# Altium project power_board.PrjPcb
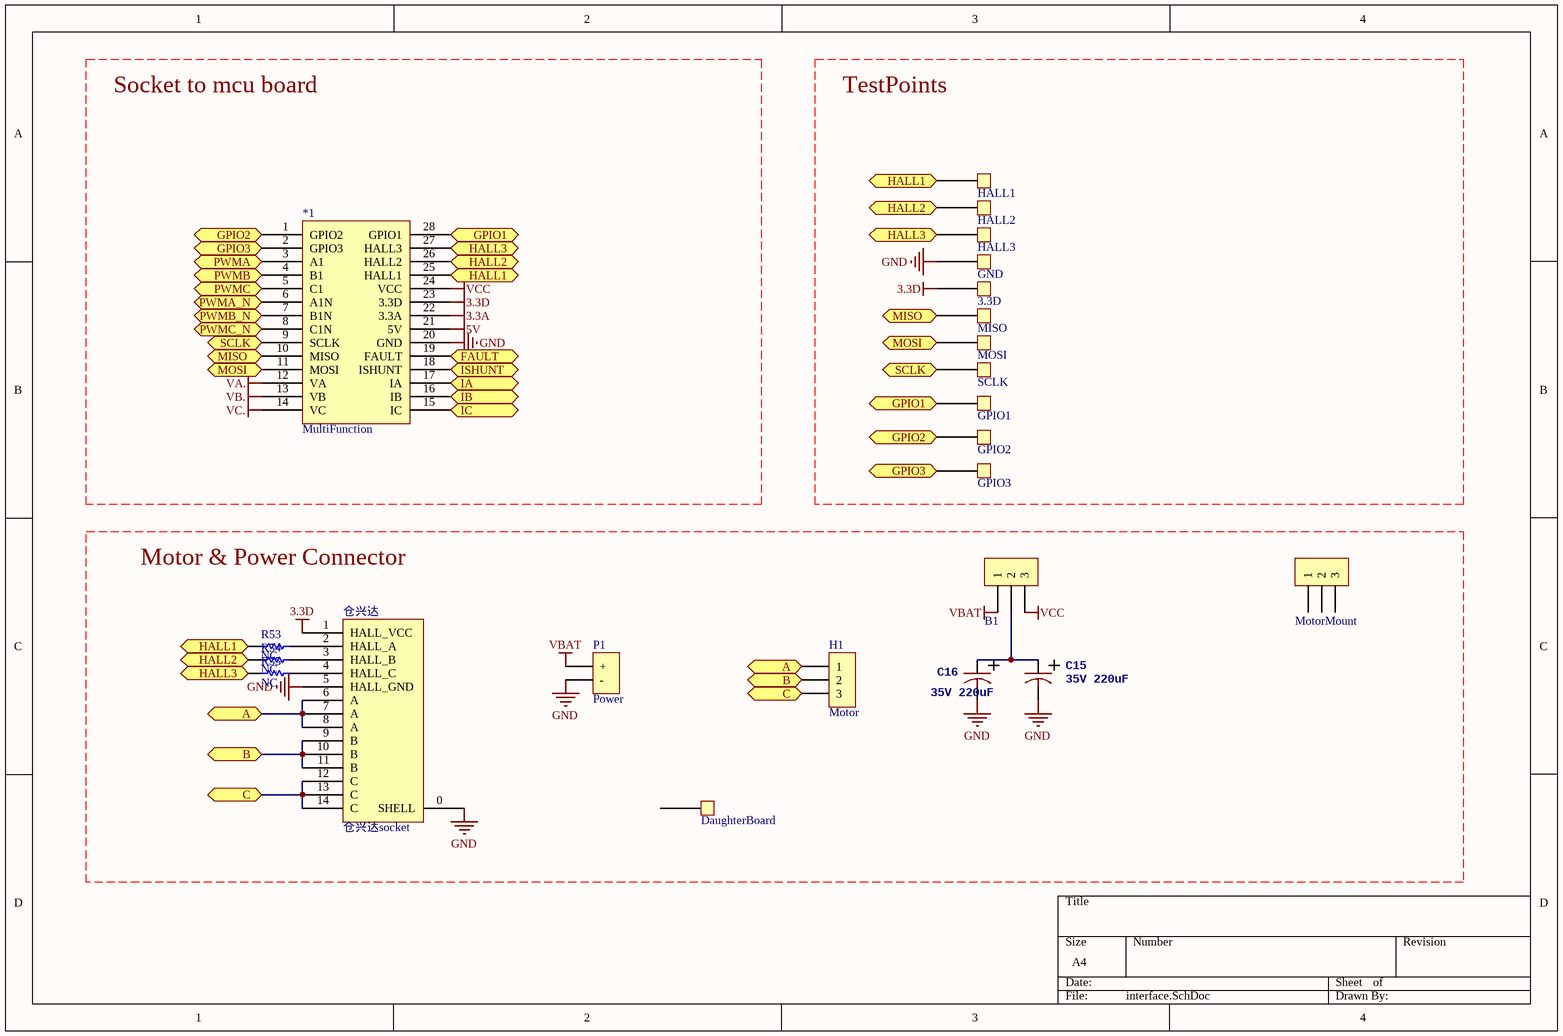
[diagram p0: interface.SchDoc]
5 sheets, 118 parts. Net scope: flat (ports and power ports of the same name join across sheets).
Board file: power.PcbDoc
Sheets:
  interface.SchDoc
  drv8313.SchDoc
  drive-mp1907.SchDoc
  signal_conditioning.SchDoc
  sensor.SchDoc

## Sheet interface.SchDoc
size A4

### Parts
3.3D  TestPad  [TestPad]  (value not drawn)
*1  MultiFunction  [MultiFunction]
B1  RX  [SolderBridge60mil]  (value not drawn)
C15  35V 220uF  [HONOR_63X77]
C16  35V 220uF  [HONOR_63X77]
DaughterBoard  TestPad  [DaughterBoardHolder]  (value not drawn)
GND  TestPad  [TestPad]  (value not drawn)
GPIO1  TestPad  [TestPad]  (value not drawn)
GPIO2  TestPad  [TestPad]  (value not drawn)
GPIO3  TestPad  [TestPad]  (value not drawn)
H1  Motor  [MotorConnector2.5mm*3]
HALL1  TestPad  [TestPad]  (value not drawn)
HALL2  TestPad  [TestPad]  (value not drawn)
HALL3  TestPad  [TestPad]  (value not drawn)
MISO  TestPad  [TestPad]  (value not drawn)
MOSI  TestPad  [TestPad]  (value not drawn)
MotorMount  RX  [MotorMount]  (value not drawn)
P1  Power  [Power]
R53  NC  [0603]
R54  NC  [0603]
R55  NC  [0603]
SCLK  TestPad  [TestPad]  (value not drawn)
仓兴达  仓兴达socket  [FPC-0.5mm-14]

### Ports
A, B, C, FAULT, GPIO1, GPIO2, GPIO3, HALL1, HALL2, HALL3, IA, IB, IC, ISHUNT, MISO, MOSI, PWMA, PWMA_N, PWMB, PWMB_N, PWMC, PWMC_N, SCLK

### Nets
3.3A: *1.22(3.3A)
3.3D: 3.3D.1 *1.23(3.3D) 仓兴达.1(HALL_VCC)
5V: *1.21(5V)
GND: *1.20(GND) C15.2 C16.2 GND.1 P1.2(-) 仓兴达.0(SHELL) 仓兴达.5(HALL_GND)
VA.: *1.12(VA)
VB.: *1.13(VB)
VBAT: B1.1 P1.1(+)
VC.: *1.14(VC)
VCC: *1.24(VCC) B1.3
Net8313_5: H1.1 仓兴达.6(A) 仓兴达.7(A) 仓兴达.8(A) ; port A
Net8313_8: H1.2 仓兴达.9(B) 仓兴达.10(B) 仓兴达.11(B) ; port B
Net8313_9: H1.3 仓兴达.12(C) 仓兴达.13(C) 仓兴达.14(C) ; port C
Net8313_22: *1.25(HALL1) HALL1.1 R53.1 ; port HALL1
Net8313_23: *1.5(C1) ; port PWMC
Net8313_25: *1.4(B1) ; port PWMB
Net8313_27: *1.3(A1) ; port PWMA
Net*1_1: *1.1(GPIO2) GPIO2.1 ; port GPIO2
Net*1_2: *1.2(GPIO3) GPIO3.1 ; port GPIO3
Net*1_6: *1.6(A1N) ; port PWMA_N
Net*1_7: *1.7(B1N) ; port PWMB_N
Net*1_8: *1.8(C1N) ; port PWMC_N
Net*1_9: *1.9(SCLK) SCLK.1 ; port SCLK
Net*1_10: *1.10(MISO) MISO.1 ; port MISO
Net*1_11: *1.11(MOSI) MOSI.1 ; port MOSI
Net*1_15: *1.15(IC) ; port IC
Net*1_16: *1.16(IB) ; port IB
Net*1_17: *1.17(IA) ; port IA
Net*1_18: *1.18(ISHUNT) ; port ISHUNT
Net*1_19: *1.19(FAULT) ; port FAULT
Net*1_26: *1.26(HALL2) HALL2.1 R54.1 ; port HALL2
Net*1_27: *1.27(HALL3) HALL3.1 R55.1 ; port HALL3
Net*1_28: *1.28(GPIO1) GPIO1.1 ; port GPIO1
NetB1_2: B1.2 C15.1 C16.1
NetR53_2: R53.2 仓兴达.2(HALL_A)
NetR54_2: R54.2 仓兴达.3(HALL_B)
NetR55_2: R55.2 仓兴达.4(HALL_C)

Not connected (* = marked no-connect by the designer): DaughterBoard 1(3); MotorMount 1 2 3

### Notes on the sheet
- Socket to mcu board
- TestPoints
- Motor & Power Connector

### Library data of the parts
B1 MotorMount = SolderBridge: Connector
C15 C16 = C-USC0402: 电容
H1 = CON3: Connector
P1 = PowerCon: Connector
R53-R55 = Res1: Resistor; Value: 10K; Published: 8-Jun-2000; LatestRevisionDate: 17-Jul-2002; LatestRevisionNote: Re-released for DXP Platform.; PackageReference: AXIAL-0.3; Publisher: Altium Limited; PackageDescription: Axial Device, Thru-Hole; 2 Leads; 0.3 in Pin Spacing

## Sheet drv8313.SchDoc
size A4
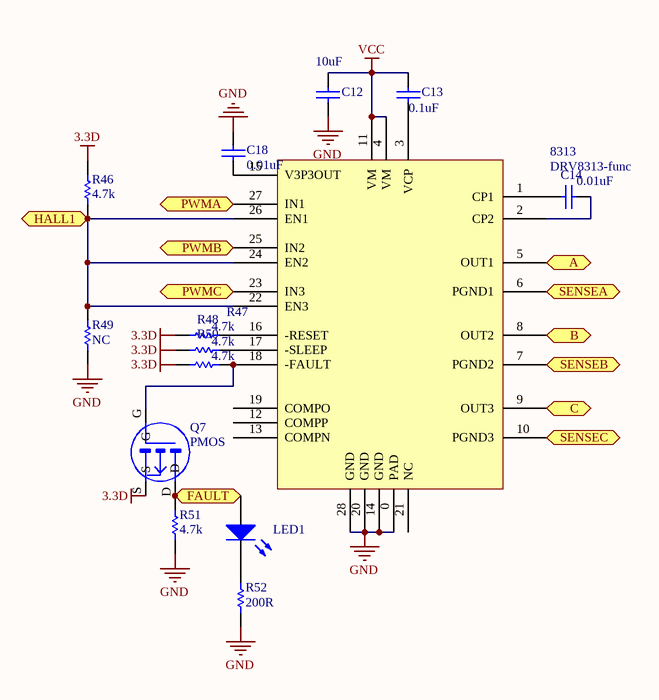
[diagram p1: drv8313.SchDoc]

### Parts
8313  DRV8313-func  [DRV8313]
C12  10uF  [0805]
C13  0.1uF  [0603]
C14  0.01uF  [0603]
C18  0.01uF  [0603]
LED1  LED0  [0603]  (value not drawn)
Q7  PMOS  [SOT-23B_L]
R46  4.7k  [0603]
R47  4.7k  [0603]
R48  4.7k  [0603]
R49  NC  [0603]
R50  4.7k  [0603]
R51  4.7k  [0603]
R52  200R  [0603]

### Ports
A, B, C, FAULT, HALL1, PWMA, PWMB, PWMC, SENSEA, SENSEB, SENSEC

### Nets
3.3D: Q7.S R46.1 R47.1 R48.1 R50.1
GND: 8313.0(PAD) 8313.14(GND) 8313.20(GND) 8313.28(GND) C12.1 C18.2 R49.2 R51.1 R52.1
VCC: 8313.4(VM) 8313.11(VM) C12.2 C13.1
Net8313_1: 8313.1(CP1) C14.1
Net8313_2: 8313.2(CP2) C14.2
Net8313_3: 8313.3(VCP) C13.2
Net8313_5: 8313.5(OUT1) ; port A
Net8313_6: 8313.6(PGND1) ; port SENSEA
Net8313_7: 8313.7(PGND2) ; port SENSEB
Net8313_8: 8313.8(OUT2) ; port B
Net8313_9: 8313.9(OUT3) ; port C
Net8313_10: 8313.10(PGND3) ; port SENSEC
Net8313_15: 8313.15(V3P3OUT) C18.1
Net8313_16: 8313.16(-RESET) R47.2
Net8313_17: 8313.17(-SLEEP) R48.2
Net8313_18: 8313.18(-FAULT) Q7.G R50.2
Net8313_22: 8313.22(EN3) 8313.24(EN2) 8313.26(EN1) R46.2 R49.1 ; port HALL1
Net8313_23: 8313.23(IN3) ; port PWMC
Net8313_25: 8313.25(IN2) ; port PWMB
Net8313_27: 8313.27(IN1) ; port PWMA
Net*1_19: LED1.1(A) Q7.D R51.2 ; port FAULT
NetLED1_2: LED1.2(K) R52.2

Not connected (* = marked no-connect by the designer): 8313 12(COMPP) 13(COMPN) 19(COMPO) 21(NC)

### Library data of the parts
C12 C13 = Cap: Capacitor; Published: 8-Jun-2000; LatestRevisionDate: 17-Jul-2002; LatestRevisionNote: Re-released for DXP Platform.; PackageReference: RAD-0.3; Publisher: Altium Limited; PackageDescription: Radial Cap, Thru-Hole; 2 Leads; 0.3 in Pin Spacing
  C12: Value: 10uF
  C13: Value: 0.1uf
C14 C18 = Cap: Capacitor; Value: 0.1uf; Published: 8-Jun-2000; LatestRevisionDate: 17-Jul-2002; LatestRevisionNote: Re-released for DXP Platform.; PackageReference: RAD-0.3; Publisher: Altium Limited; PackageDescription: Radial Cap, Thru-Hole; 2 Leads; 0.3 in Pin Spacing
LED1 = LED0: LED; Published: 8-Jun-2000; LatestRevisionDate: 08-Jul-2005; LatestRevisionNote: Mech Layer 1 removed.; PackageReference: LED-0; Publisher: Altium Limited; PackageDescription: LED; 2 Leads
Q7 = PMOS: pin to pad: D>3 G>1 S>2
R46-R52 = Res1: Resistor; Value: 10K; Published: 8-Jun-2000; LatestRevisionDate: 17-Jul-2002; LatestRevisionNote: Re-released for DXP Platform.; PackageReference: AXIAL-0.3; Publisher: Altium Limited; PackageDescription: Axial Device, Thru-Hole; 2 Leads; 0.3 in Pin Spacing

## Sheet drive-mp1907.SchDoc
size A3
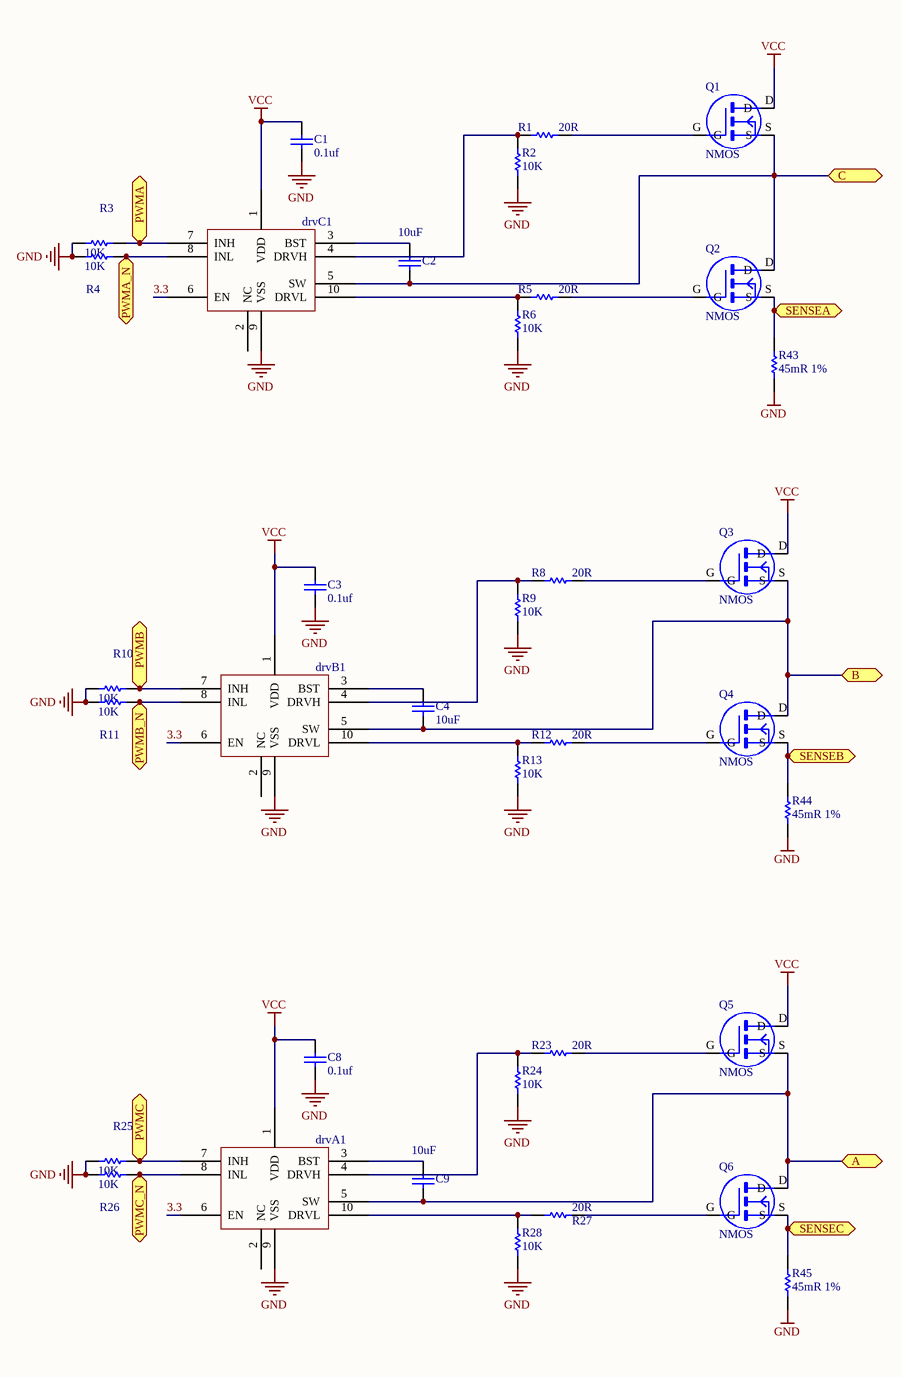
[diagram p2: drive-mp1907.SchDoc]

### Parts
C1  value 0.1uf  [0603]  (hidden comment: Cap)
C2  10uF  [0805]
C3  value 0.1uf  [0603]  (hidden comment: Cap)
C4  value 10uF  [0805]  (hidden comment: Cap)
C8  value 0.1uf  [0603]  (hidden comment: Cap)
C9  10uF  [0805]
drvA1  MP1907  [MP1907]  (value not drawn)
drvB1  MP1907  [MP1907]  (value not drawn)
drvC1  MP1907  [MP1907]  (value not drawn)
Q1  NMOS  [BSC025N03MS]
Q2  NMOS  [BSC025N03MS]
Q3  NMOS  [BSC025N03MS]
Q4  NMOS  [BSC025N03MS]
Q5  NMOS  [BSC025N03MS]
Q6  NMOS  [BSC025N03MS]
R1  value 20R  [0603]  (hidden comment: Res1)
R2  value 10K  [0603]  (hidden comment: Res1)
R3  value 10K  [0603]  (hidden comment: Res1)
R4  value 10K  [0603]  (hidden comment: Res1)
R5  value 20R  [0603]  (hidden comment: Res1)
R6  value 10K  [0603]  (hidden comment: Res1)
R8  value 20R  [0603]  (hidden comment: Res1)
R9  value 10K  [0603]  (hidden comment: Res1)
R10  value 10K  [0603]  (hidden comment: Res1)
R11  value 10K  [0603]  (hidden comment: Res1)
R12  value 20R  [0603]  (hidden comment: Res1)
R13  value 10K  [0603]  (hidden comment: Res1)
R23  value 20R  [0603]  (hidden comment: Res1)
R24  value 10K  [0603]  (hidden comment: Res1)
R25  value 10K  [0603]  (hidden comment: Res1)
R26  value 10K  [0603]  (hidden comment: Res1)
R27  value 20R  [0603]  (hidden comment: Res1)
R28  value 10K  [0603]  (hidden comment: Res1)
R43  45mR 1%  [2512]
R44  45mR 1%  [2512]
R45  45mR 1%  [2512]

### Ports
A, B, C, PWMA, PWMA_N, PWMB, PWMB_N, PWMC, PWMC_N, SENSEA, SENSEB, SENSEC

### Nets
GND: C1.2 C3.2 C8.2 drvA1.9(VSS) drvB1.9(VSS) drvC1.9(VSS) R2.2 R3.2 R4.2 R6.2 R9.2 R10.2 R11.2 R13.2 R24.2 R25.2 R26.2 R28.2 R43.1 R44.1 R45.1
VCC: C1.1 C3.1 C8.1 drvA1.1(VDD) drvB1.1(VDD) drvC1.1(VDD) Q1.D Q3.D Q5.D
3.3: drvA1.6(EN) drvB1.6(EN) drvC1.6(EN)
Net8313_5: C9.1 drvA1.5(SW) Q5.S Q6.D ; port A
Net8313_6: Q2.S R43.2 ; port SENSEA
Net8313_7: Q4.S R44.2 ; port SENSEB
Net8313_8: C4.1 drvB1.5(SW) Q3.S Q4.D ; port B
Net8313_9: C2.1 drvC1.5(SW) Q1.S Q2.D ; port C
Net8313_10: Q6.S R45.2 ; port SENSEC
Net8313_23: drvA1.7(INH) R25.1 ; port PWMC
Net8313_25: drvB1.7(INH) R10.1 ; port PWMB
Net8313_27: drvC1.7(INH) R3.1 ; port PWMA
Net*1_6: drvC1.8(INL) R4.1 ; port PWMA_N
Net*1_7: drvB1.8(INL) R11.1 ; port PWMB_N
Net*1_8: drvA1.8(INL) R26.1 ; port PWMC_N
NetC2_2: C2.2 drvC1.3(BST)
NetC4_2: C4.2 drvB1.3(BST)
NetC9_2: C9.2 drvA1.3(BST)
NetdrvA1_4: drvA1.4(DRVH) R23.2 R24.1
NetdrvA1_10: drvA1.10(DRVL) R27.2 R28.1
NetdrvB1_4: drvB1.4(DRVH) R8.2 R9.1
NetdrvB1_10: drvB1.10(DRVL) R12.2 R13.1
NetdrvC1_4: drvC1.4(DRVH) R1.2 R2.1
NetdrvC1_10: drvC1.10(DRVL) R5.2 R6.1
NetQ1_G: Q1.G R1.1
NetQ2_G: Q2.G R5.1
NetQ3_G: Q3.G R8.1
NetQ4_G: Q4.G R12.1
NetQ5_G: Q5.G R23.1
NetQ6_G: Q6.G R27.1

Not connected (* = marked no-connect by the designer): drvA1 2(NC); drvB1 2(NC); drvC1 2(NC)

### Library data of the parts
C1 C3 C4 C8 = Cap: Capacitor; Published: 8-Jun-2000; LatestRevisionDate: 17-Jul-2002; LatestRevisionNote: Re-released for DXP Platform.; PackageReference: RAD-0.3; Publisher: Altium Limited; PackageDescription: Radial Cap, Thru-Hole; 2 Leads; 0.3 in Pin Spacing
C2 C9 = Cap: Capacitor; Value: 0.1uf; Published: 8-Jun-2000; LatestRevisionDate: 17-Jul-2002; LatestRevisionNote: Re-released for DXP Platform.; PackageReference: RAD-0.3; Publisher: Altium Limited; PackageDescription: Radial Cap, Thru-Hole; 2 Leads; 0.3 in Pin Spacing
R1-R6 R8-R13 R23-R28 = Res1: Resistor; Published: 8-Jun-2000; LatestRevisionDate: 17-Jul-2002; LatestRevisionNote: Re-released for DXP Platform.; PackageReference: AXIAL-0.3; Publisher: Altium Limited; PackageDescription: Axial Device, Thru-Hole; 2 Leads; 0.3 in Pin Spacing
R43-R45 = Res1: Resistor; Value: 10K; Published: 8-Jun-2000; LatestRevisionDate: 17-Jul-2002; LatestRevisionNote: Re-released for DXP Platform.; PackageReference: AXIAL-0.3; Publisher: Altium Limited; PackageDescription: Axial Device, Thru-Hole; 2 Leads; 0.3 in Pin Spacing

## Sheet signal_conditioning.SchDoc
size A4
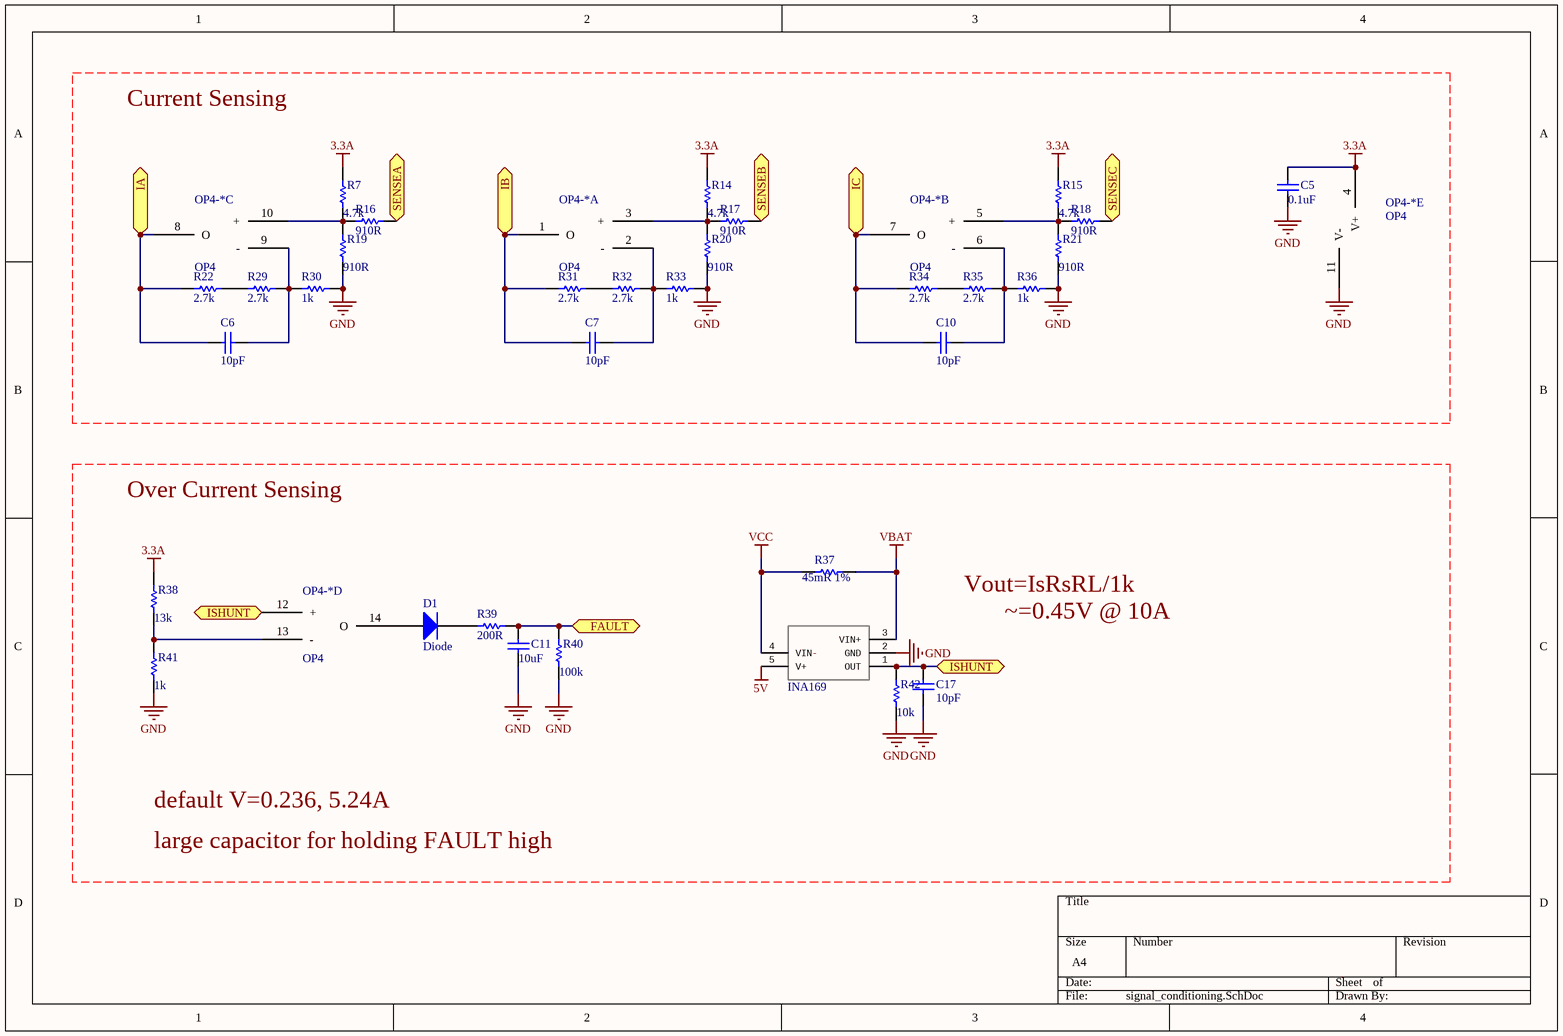
[diagram p3: signal_conditioning.SchDoc]

### Parts
C5  0.1uF  [0603]
C6  10pF  [0603]
C7  10pF  [0603]
C10  10pF  [0603]
C11  10uF  [0805]
C17  10pF  [0603]
D1  Diode  [0805]
OP4-*  OP4  [SOP14]  (parts A,B,C,D,E of 5)
R7  4.7k  [0603]
R14  4.7k  [0603]
R15  4.7k  [0603]
R16  910R  [0603]
R17  910R  [0603]
R18  910R  [0603]
R19  910R  [0603]
R20  910R  [0603]
R21  910R  [0603]
R22  2.7k  [0603]
R29  2.7k  [0603]
R30  1k  [0603]
R31  2.7k  [0603]
R32  2.7k  [0603]
R33  1k  [0603]
R34  2.7k  [0603]
R35  2.7k  [0603]
R36  1k  [0603]
R37  45mR 1%  [2512]
R38  13k  [0603]
R39  200R  [0603]
R40  100k  [0603]
R41  1k  [0603]
R42  10k  [0603]
U$1  INA169  [SOT23-5]

### Ports
FAULT, IA, IB, IC, ISHUNT, SENSEA, SENSEB, SENSEC

### Nets
3.3A: C5.1 OP4-*.4(V+) R7.2 R14.2 R15.2 R38.2
5V: U$1.5(V+)
GND: C5.2 C11.2 C17.1 OP4-*.11(V-) R19.1 R20.1 R21.1 R30.1 R33.1 R36.1 R40.1 R41.1 R42.1 U$1.2(GND)
VBAT: R37.2 U$1.3(VIN+)
VCC: R37.1 U$1.4(VIN-)
Net8313_6: R16.1 ; port SENSEA
Net8313_7: R17.1 ; port SENSEB
Net8313_10: R18.1 ; port SENSEC
Net*1_15: C10.1 OP4-*.7(O) R34.2 ; port IC
Net*1_16: C7.1 OP4-*.1(O) R31.2 ; port IB
Net*1_17: C6.1 OP4-*.8(O) R22.2 ; port IA
Net*1_18: C17.2 OP4-*.12(+) R42.2 U$1.1(OUT) ; port ISHUNT
Net*1_19: C11.1 R39.1 R40.2 ; port FAULT
NetC6_2: C6.2 OP4-*.9(-) R29.1 R30.2
NetC7_2: C7.2 OP4-*.2(-) R32.1 R33.2
NetC10_2: C10.2 OP4-*.6(-) R35.1 R36.2
NetD1_1: D1.1(A) OP4-*.14(O)
NetD1_2: D1.2(K) R39.2
NetOP4-*_3: OP4-*.3(+) R14.1 R17.2 R20.2
NetOP4-*_5: OP4-*.5(+) R15.1 R18.2 R21.2
NetOP4-*_10: OP4-*.10(+) R7.1 R16.2 R19.2
NetOP4-*_13: OP4-*.13(-) R38.1 R41.2
NetR22_1: R22.1 R29.2
NetR31_1: R31.1 R32.2
NetR34_1: R34.1 R35.2

### Notes on the sheet
- Current Sensing
- Over Current Sensing
- Vout=IsRsRL/1k
- ~=0.45V @ 10A
- default V=0.236, 5.24A
- large capacitor for holding FAULT high

### Library data of the parts
C5 = Cap: Capacitor; Published: 8-Jun-2000; LatestRevisionDate: 17-Jul-2002; LatestRevisionNote: Re-released for DXP Platform.; PackageReference: RAD-0.3; Publisher: Altium Limited; PackageDescription: Radial Cap, Thru-Hole; 2 Leads; 0.3 in Pin Spacing; Value: 0.1uf
C6 C7 C10 C11 C17 = Cap: Capacitor; Value: 0.1uf; Published: 8-Jun-2000; LatestRevisionDate: 17-Jul-2002; LatestRevisionNote: Re-released for DXP Platform.; PackageReference: RAD-0.3; Publisher: Altium Limited; PackageDescription: Radial Cap, Thru-Hole; 2 Leads; 0.3 in Pin Spacing
D1 = Diode: Default Diode; Published: 8-Jun-2000; LatestRevisionDate: 17-Jul-2002; LatestRevisionNote: Re-released for DXP Platform.; PackageVersion: Sep-1996; PackageReference: SMC; Publisher: Altium Limited; PackageDescription: DO-214-AB/SMC; 2 C-Bend Leads; Body 7.9 x 5.9 mm, inc. leads (LxW); Code_JEDEC: DO-214-AB
R7 R14-R22 R29-R41 = Res1: Resistor; Value: 10K; Published: 8-Jun-2000; LatestRevisionDate: 17-Jul-2002; LatestRevisionNote: Re-released for DXP Platform.; PackageReference: AXIAL-0.3; Publisher: Altium Limited; PackageDescription: Axial Device, Thru-Hole; 2 Leads; 0.3 in Pin Spacing
R42 = Res1: Resistor; Published: 8-Jun-2000; LatestRevisionDate: 17-Jul-2002; LatestRevisionNote: Re-released for DXP Platform.; PackageReference: AXIAL-0.3; Publisher: Altium Limited; PackageDescription: Axial Device, Thru-Hole; 2 Leads; 0.3 in Pin Spacing; Value: 10K

## Sheet sensor.SchDoc
size A4
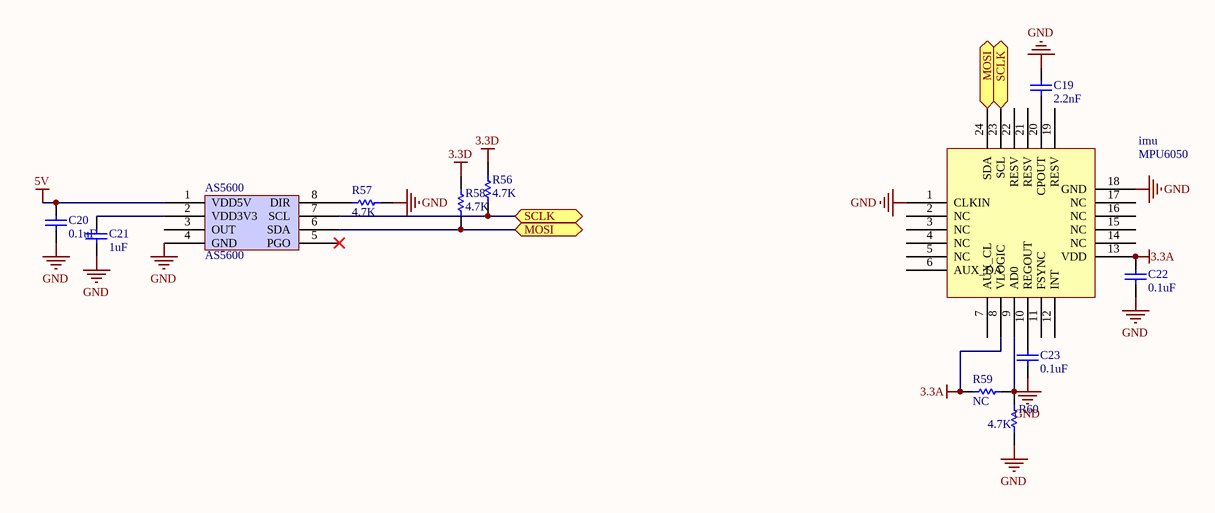
[diagram p4: sensor.SchDoc]

### Parts
AS5600  AS5600  [SOIC8_39MM]
C19  2.2nF  [0603]
C20  0.1uF  [0603]
C21  1uF  [0603]
C22  0.1uF  [0603]
C23  0.1uF  [0603]
imu  MPU6050  [MPU6050-2]
R56  4.7K  [0603]
R57  4.7K  [0603]
R58  4.7K  [0603]
R59  NC  [0603]
R60  4.7K  [0603]

### Ports
MOSI, SCLK

### Nets
3.3A: C22.2 imu.8(VLOGIC) imu.13(VDD) R59.1
3.3D: R56.2 R58.2
5V: AS5600.1(VDD5V) C20.1
GND: AS5600.4(GND) C19.2 C20.2 C21.1 C22.1 C23.1 imu.1(CLKIN) imu.18(GND) R57.2 R60.2
Net*1_9: AS5600.7(SCL) imu.23(SCL) R56.1 ; port SCLK
Net*1_11: AS5600.6(SDA) imu.24(SDA) R58.1 ; port MOSI
NetAS5600_2: AS5600.2(VDD3V3) C21.2
NetAS5600_8: AS5600.8(DIR) R57.1
NetC19_1: C19.1 imu.20(CPOUT)
NetC23_2: C23.2 imu.10(REGOUT)
Netimu_9: imu.9(AD0) R59.2 R60.1

Not connected (* = marked no-connect by the designer): AS5600 3(OUT) 5(PGO)*; imu 2(NC) 3(NC) 4(NC) 5(NC) 6(AUX_DA) 7(AUX_CL) 11(FSYNC) 12(INT) 14(NC) 15(NC) 16(NC) 17(NC) 19(RESV) 21(RESV) 22(RESV)

### Library data of the parts
C19 C21 = Cap: Capacitor; Value: 0.1uf; Published: 8-Jun-2000; LatestRevisionDate: 17-Jul-2002; LatestRevisionNote: Re-released for DXP Platform.; PackageReference: RAD-0.3; Publisher: Altium Limited; PackageDescription: Radial Cap, Thru-Hole; 2 Leads; 0.3 in Pin Spacing
C20 C22 C23 = Cap: Capacitor; Published: 8-Jun-2000; LatestRevisionDate: 17-Jul-2002; LatestRevisionNote: Re-released for DXP Platform.; PackageReference: RAD-0.3; Publisher: Altium Limited; PackageDescription: Radial Cap, Thru-Hole; 2 Leads; 0.3 in Pin Spacing; Value: 0.1uf
R56-R60 = Res1: Resistor; Value: 10K; Published: 8-Jun-2000; LatestRevisionDate: 17-Jul-2002; LatestRevisionNote: Re-released for DXP Platform.; PackageReference: AXIAL-0.3; Publisher: Altium Limited; PackageDescription: Axial Device, Thru-Hole; 2 Leads; 0.3 in Pin Spacing

## Nets that join several sheets
3.3A: interface (*1.22), signal_conditioning (6 pins), sensor (C22.2 imu.8 imu.13 R59.1)
3.3D: interface (3.3D.1 *1.23 仓兴达.1), drv8313 (5 pins), sensor (R56.2 R58.2)
5V: interface (*1.21), signal_conditioning (U$1.5), sensor (AS5600.1 C20.1)
GND: interface (7 pins), drv8313 (9 pins), drive-mp1907 (21 pins), signal_conditioning (14 pins), sensor (10 pins)
VBAT: interface (B1.1 P1.1), signal_conditioning (R37.2 U$1.3)
VCC: interface (*1.24 B1.3), drv8313 (8313.4 8313.11 C12.2 C13.1), drive-mp1907 (9 pins), signal_conditioning (R37.1 U$1.4)
Net8313_5: interface (H1.1 仓兴达.6 仓兴达.7 仓兴达.8), drv8313 (8313.5), drive-mp1907 (C9.1 drvA1.5 Q5.S Q6.D)
Net8313_6: drv8313 (8313.6), drive-mp1907 (Q2.S R43.2), signal_conditioning (R16.1)
Net8313_7: drv8313 (8313.7), drive-mp1907 (Q4.S R44.2), signal_conditioning (R17.1)
Net8313_8: interface (H1.2 仓兴达.9 仓兴达.10 仓兴达.11), drv8313 (8313.8), drive-mp1907 (C4.1 drvB1.5 Q3.S Q4.D)
Net8313_9: interface (H1.3 仓兴达.12 仓兴达.13 仓兴达.14), drv8313 (8313.9), drive-mp1907 (C2.1 drvC1.5 Q1.S Q2.D)
Net8313_10: drv8313 (8313.10), drive-mp1907 (Q6.S R45.2), signal_conditioning (R18.1)
Net8313_22: interface (*1.25 HALL1.1 R53.1), drv8313 (5 pins)
Net8313_23: interface (*1.5), drv8313 (8313.23), drive-mp1907 (drvA1.7 R25.1)
Net8313_25: interface (*1.4), drv8313 (8313.25), drive-mp1907 (drvB1.7 R10.1)
Net8313_27: interface (*1.3), drv8313 (8313.27), drive-mp1907 (drvC1.7 R3.1)
Net*1_6: interface (*1.6), drive-mp1907 (drvC1.8 R4.1)
Net*1_7: interface (*1.7), drive-mp1907 (drvB1.8 R11.1)
Net*1_8: interface (*1.8), drive-mp1907 (drvA1.8 R26.1)
Net*1_9: interface (*1.9 SCLK.1), sensor (AS5600.7 imu.23 R56.1)
Net*1_11: interface (*1.11 MOSI.1), sensor (AS5600.6 imu.24 R58.1)
Net*1_15: interface (*1.15), signal_conditioning (C10.1 OP4-*.7 R34.2)
Net*1_16: interface (*1.16), signal_conditioning (C7.1 OP4-*.1 R31.2)
Net*1_17: interface (*1.17), signal_conditioning (C6.1 OP4-*.8 R22.2)
Net*1_18: interface (*1.18), signal_conditioning (C17.2 OP4-*.12 R42.2 U$1.1)
Net*1_19: interface (*1.19), drv8313 (LED1.1 Q7.D R51.2), signal_conditioning (C11.1 R39.1 R40.2)